# Altium schematic sheet Laser_module_supply.schdoc: Laser Module
size 420 x 297 mm; CheckedBy: MK; Author: G.K.; CompanyName: CREOTECH; DrawnBy: G.K.; Organization: CTI SA; Address1: Creotech Instruments SA; Address2: Okulickiego 7/9, 05-500 Poland; DocumentNumber: 5; Revision: -; SheetNumber: 5; SheetTotal: 5; ModifiedBy: -; CreateDate: XX/XX/XXXX; CheckedDate: -; Title2: Supply; DivGrp: CTI; Designer: G.K.; ModifiedDate: -; ProjectName: FMC DAC 100M 14B 16CHA ADC 2M 14B 4CHA
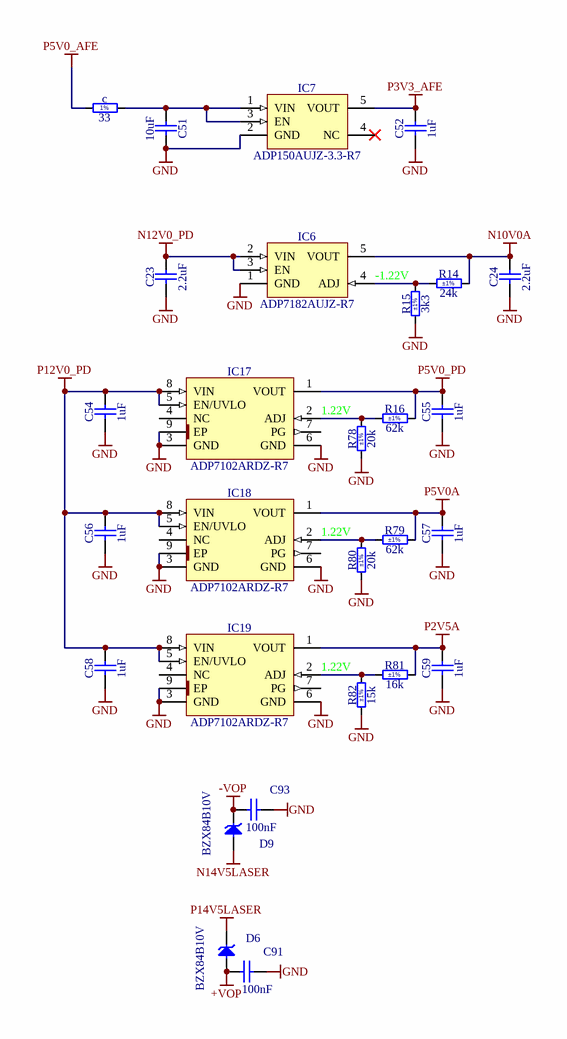
[diagram p0: Laser_module_supply.schdoc]

## Parts
c  33  [RESC1005X40N]
C23  2.2uF  [CAPC2012X135N]
C24  2.2uF  [CAPC2012X135N]
C51  10uF  [CAPC2012X135N]
C52  1uF  [CAPC1608X87N]
C54  1uF  [CAPC1608X87N]
C55  1uF  [CAPC1608X87N]
C56  1uF  [CAPC1608X87N]
C57  1uF  [CAPC1608X87N]
C58  1uF  [CAPC1608X87N]
C59  1uF  [CAPC1608X87N]
C91  100nF  [CAPC1608X87N]
C93  100nF  [CAPC1608X87N]
D6  BZX84B10V  [SOT95P248X115-3N]
D9  BZX84B10V  [SOT95P248X115-3N]
IC6  ADP7182AUJZ-R7  [SOT95P280X90-5N]
IC7  ADP150AUJZ-3.3-R7  [SOT95P280X90-5N]
IC17  ADP7102ARDZ-R7  [SOIC127P600X175-9N-R241X309]
IC18  ADP7102ARDZ-R7  [SOIC127P600X175-9N-R241X309]
IC19  ADP7102ARDZ-R7  [SOIC127P600X175-9N-R241X309]
R14  24k  Tolerance: ±1%  [RESC1005X40N]
R15  3k3  Tolerance: ±1%  [RESC1005X40N]
R16  62k  Tolerance: ±1%  [RESC1005X40N]
R78  20k  Tolerance: ±1%  [RESC1005X40N]
R79  62k  Tolerance: ±1%  [RESC1005X40N]
R80  20k  Tolerance: ±1%  [RESC1005X40N]
R81  16k  Tolerance: ±1%  [RESC1005X40N]
R82  15k  Tolerance: ±1%  [RESC1005X40N]

## Nets
+VOP: C91.1 D6.1(A)
-VOP: C93.1 D9.3(C)
GND: C23.1 C24.1 C51.2 C52.1 C54.1 C55.1 C56.1 C57.1 C58.1 C59.1 C91.2 C93.2 IC6.1(GND) IC7.2(GND) IC17.3(GND) IC17.6(GND) IC17.9(EP) IC18.3(GND) IC18.6(GND) IC18.9(EP) IC19.3(GND) IC19.6(GND) IC19.9(EP) R15.1 R78.1 R80.1 R82.1
N10V0A: C24.2 IC6.5(VOUT) R14.2
N12V0_PD: C23.2 IC6.2(VIN) IC6.3(EN)
N14V5LASER: D9.1(A)
P2V5A: C59.2 IC19.1(VOUT) R81.2
P3V3_AFE: C52.2 IC7.5(VOUT)
P5V0_AFE: c.1
P5V0_PD: C55.2 IC17.1(VOUT) R16.2
P5V0A: C57.2 IC18.1(VOUT) R79.2
P12V0_PD: C54.2 C56.2 C58.2 IC17.5(EN/UVLO) IC17.8(VIN) IC18.5(EN/UVLO) IC18.8(VIN) IC19.5(EN/UVLO) IC19.8(VIN)
P14V5LASER: D6.3(C)
Netc_2: c.2 C51.1 IC7.1(VIN) IC7.3(EN)
NetIC6_4: IC6.4(ADJ) R14.1 R15.2
NetIC17_2: IC17.2(ADJ) R16.1 R78.2
NetIC18_2: IC18.2(ADJ) R79.1 R80.2
NetIC19_2: IC19.2(ADJ) R81.1 R82.2

Not connected (* = marked no-connect by the designer): IC7 4(NC)*; IC17 4(NC) 7(PG); IC18 4(NC) 7(PG); IC19 4(NC) 7(PG)

## Notes on the sheet
- (near R15) -1.22V
- (near R78) 1.22V
- (near R80) 1.22V
- (near R82) 1.22V
- Project/Equipment
- Document
- Designer
- Drawn by
- Check.by
- Copyright Creotech Instruments SA 2014.
  This documentation describes Open Hardware and is licensed under the CERN OHL v.1.1. You may redistribute and modify this documentation under the terms of the CERN OHL v.1.1. (http://ohwr.org/CERNOHL). This documentation is distributed WITHOUT ANY EXPRESS OR IMPLIED WARRANTY, INCLUDING OF MERCHANTABILITY, SATISFACTORY QUALITY AND FITNESS FOR A PARTICULAR PURPOSE. Please see the CERN OHL v.1.1 for applicable conditions.
- File
- Last Mod.
- Print Date
- Sheet
- Size
- A3
- of
- Rev
- (in symbol R0402_33R_1%_0.0625W_100PPM) 1%

## Library data of the parts
c = R0402_33R_1%_0.0625W_100PPM: Resistor - 1%; Part Description: General Purpose Thick Film Chip Resistor; Manufacturer: GENERIC; Manufacturer1 Part Number: 232270673309L; TC: ±100ppm/°C; PressFit: No; Part Number: R0402_33R_1%_0.0625W_100PPM; Component Kind: Standard; Component Type: Standard; Pin Count: 2; Value: 33; Status: Not Recommended; Power: 0.0625W; Tolerance: ±1%; Manufacturer Part Number: R0402_33R_1%_0.0625W_100PPM; Case: 0402; Mounted: Yes; Sense: No; Socket: No; SMD: Yes; Manufacturer1 Example: YAGEO PHYCOMP; Manufacturer1 ComponentHeight: 0.4mm; HelpURL: \\cern.ch\dfs\Applications\Altium\Datasheets\R0402_Phycomp_RC0402.pdf; Author: CERN DEM JLC; CreateDate: 03/12/2007; LatestRevisionDate: 17/10/2012
C23 C24 = CC0805_2.2UF_16V_10%_X7R: Non-polarised capacitor; Part Description: SMD Multilayer Chip Ceramic Capacitor; Manufacturer: GENERIC; Manufacturer1 Part Number: GRM21BF51C225ZA01L; Voltage: 16V; TC: X7R; Tolerance: ±10%; Part Number: CC0805_2.2UF_16V_10%_X7R; Component Kind: Standard; Component Type: Standard; Pin Count: 2; Value: 2.2uF; Status: Preferred; Manufacturer Part Number: CC0805_2.2UF_16V_10%_X7R; Case: 0805; Mounted: Yes; Socket: No; SMD: Yes; Sense: No; Manufacturer1 Example: MURATA; Manufacturer1 ComponentHeight: 1.5mm; HelpURL: \\cern.ch\dfs\Applications\Altium\Datasheets\CC0805_X7R_MURATA_GRM.pdf; Author: CERN DEM JLC; CreateDate: 03.12.2007; LatestRevisionDate: 18.09.2014
C51 = CC0805_10UF_16V_10%_X5R: Non-polarised capacitor; Part Description: SMD Multilayer Chip Ceramic Capacitor; Manufacturer: GENERIC; Manufacturer1 Part Number: C0805C106K4PAC; Voltage: 16V; TC: X5R; Tolerance: ±10%; Part Number: CC0805_10UF_16V_10%_X5R; Component Kind: Standard; Component Type: Standard; Pin Count: 2; Value: 10uF; Status: Preferred; Manufacturer Part Number: CC0805_10UF_16V_10%_X5R; Case: 0805; Mounted: Yes; Socket: No; SMD: Yes; Manufacturer1 Example: KEMET; Manufacturer1 ComponentHeight: 1.4mm; HelpURL: \\cern.ch\dfs\Applications\Altium\Datasheets\CC1206_X5R_KEMET.pdf; Author: CERN DEM JLC; CreateDate: 03.12.2007; LatestRevisionDate: 03.12.2007; Sense: No
C52 C54-C59 = CC0603_1UF_25V_10%_X7R: Non-polarised capacitor; Part Description: SMD Multilayer Chip Ceramic Capacitor; Manufacturer: GENERIC; Manufacturer1 Part Number: GRM188R71E105KA12D; Voltage: 25V; TC: X7R; Tolerance: ±10%; Part Number: CC0603_1UF_25V_10%_X7R; Component Kind: Standard; Component Type: Standard; Pin Count: 2; Value: 1uF; Status: None; Manufacturer Part Number: CC0603_1UF_25V_10%_X7R; Case: 0603; Mounted: Yes; Socket: No; SMD: Yes; Sense: No; Manufacturer1 Example: MURATA; Manufacturer1 ComponentHeight: 0.9mm; HelpURL: \\cern.ch\dfs\Applications\Altium\Datasheets\CC0603_X7R_MURATA.pdf; Author: CERN DEM JLC; CreateDate: 18/01/2011; LatestRevisionDate: 18/01/2011
C91 C93 = CC0603_100NF_50V_10%_X7R: Non-polarised capacitor; Part Description: SMD Multilayer Chip Ceramic Capacitor; Manufacturer: GENERIC; Manufacturer1 Part Number: 223858615649; Voltage: 50V; TC: X7R; Tolerance: ±10%; Part Number: CC0603_100NF_50V_10%_X7R; Component Kind: Standard; Component Type: Standard; Pin Count: 2; Value: 100nF; Status: Preferred; Manufacturer Part Number: CC0603_100NF_50V_10%_X7R; Case: 0603; Mounted: Yes; Socket: No; SMD: Yes; Sense: No; Manufacturer1 Example: PHYCOMP; Manufacturer1 ComponentHeight: 0.87mm; HelpURL: \\cern.ch\dfs\Applications\Altium\Datasheets\CC0603_X7R_PHYCOMP.pdf; Author: CERN DEM JLC; CreateDate: 03.12.2007; LatestRevisionDate: 03.12.2007
D6 D9 = BZX84B10V: Diode Zener Anode Pin 1 Cathode Pin 3 (Pas de pin 2); Part Description: Small Signal Zener Diode; Manufacturer: VISHAY SEMICONDUCTORS; Voltage: 10V; Power: 300mW; PressFit: No; Bonding: No; Part Number: BZX84B10V; Component Kind: Standard; Component Type: Standard; Device: BZX84B10V; PackageDescription: SOT, 0.95mm Pitch; 3 Pin, 1.315mm W X 2.95mm L X 1.15mm H body, IPC Medium Density; Manufacturer Part Number: BZX84B10V; Pin Count: 2; Case: SOT23-3; Mounted: Yes; Socket: No; SMD: Yes; Sense: No; ComponentHeight: 1.15mm; HelpURL: \\cern.ch\dfs\Applications\Altium\Datasheets\BZX84B10V.pdf; Author: CERN DEM JLC; CreateDate: 23.10.2013; LatestRevisionDate: 23.10.2013
IC6 = ADP7182AUJZ-R7: -1.22V to -27V, -200mA, Adjustable, Low Noise, Negative Linear Regulator; Manufacturer: ANALOG DEVICES; PressFit: No; Bonding: No; Part Number: ADP7182AUJZ-R7; Component Kind: Standard; Component Type: Standard; Device: ADP7182AUJZ-R7; PackageDescription: SOT23, 0.95mm Pitch; 5 Pin, 1.75mm W X 3.00mm L X 0.90mm H body, IPC Medium Density; Part Description: -1.22V to -27V, -200mA, Adjustable, Low Noise, Negative Linear Regulator; Manufacturer Part Number: ADP7182AUJZ-R7; Pin Count: 5; Case: SOT23-5; Mounted: Yes; Socket: No; SMD: Yes; Sense: No; ComponentHeight: 0.9mm; HelpURL: \\cern.ch\dfs\Applications\Altium\Datasheets\ADP7182AUJZ-R7.pdf; Author: CERN DEM JLC; CreateDate: 16.06.2014; LatestRevisionDate: 16.06.2014
IC7 = ADP150AUJZ-3.3-R7: Ultralow Noise, 150 mA CMOS Linear Regulator; Part Description: 3.3V, 150mA, Ultralow Noise, CMOS Linear Regulator; Manufacturer: ANALOG DEVICES; PressFit: No; Bonding: No; Part Number: ADP150AUJZ-3.3-R7; Component Kind: Standard; Component Type: Standard; Device: ADP150AUJZ-3.3-R7; PackageDescription: SOT23, 0.95mm pitch; 5 pin, 1.75mm W X 3.00mm L, IPC Medium Density; Manufacturer Part Number: ADP150AUJZ-3.3-R7; Pin Count: 5; Case: SOT23; Mounted: Yes; Socket: No; SMD: Yes; Sense: No; ComponentHeight: 0.9mm; HelpURL: \\cern.ch\dfs\Applications\Altium\Datasheets\ADP150AUJZ-3.3-R7.pdf; Author: CERN DEM JLC; CreateDate: 27/09/2011; LatestRevisionDate: 19/06/2014
IC17-IC19 = ADP7102ARDZ-R7: 1.22V to 19V, 300mA, Low Noise, CMOS LDO Adjustable Linear Regulator; Manufacturer: ANALOG DEVICES; PressFit: No; Bonding: No; Part Number: ADP7102ARDZ-R7; Component Kind: Standard; Component Type: Standard; Device: ADP7102ARDZ-R7; PackageDescription: SOIC 8, Pitch 1.27mm - Body 3.9x4.9mm, (w/Thermal Tab 2.41mm X 3.098mm), IPC Medium Density; Part Description: 1.22V to 19V, 300mA, Low Noise, CMOS LDO Adjustable Linear Regulator; Manufacturer Part Number: ADP7102ARD; Pin Count: 8; Case: SOIC8; Mounted: Yes; Socket: No; SMD: Yes; Sense: No; ComponentHeight: 1.75mm; HelpURL: \\cern.ch\dfs\Applications\Altium\Datasheets\ADP7102ARDZ-R7.pdf; Author: CERN DEM JLC; CreateDate: 16.06.2014; LatestRevisionDate: 01.04.2022
R14 = R0402_24K_1%_0.0625W_100PPM: Resistor - 1%; Part Description: General Purpose Thick Film Chip Resistor; Manufacturer: GENERIC; Manufacturer1 Part Number: 232270672403L; TC: ±100ppm/°C; PressFit: No; Part Number: R0402_24K_1%_0.0625W_100PPM; Component Kind: Standard; Component Type: Standard; Pin Count: 2; Value: 24k; Status: Not Recommended; Power: 0.0625W; Manufacturer Part Number: R0402_24K_1%_0.0625W_100PPM; Case: 0402; Mounted: Yes; Sense: No; Socket: No; SMD: Yes; Manufacturer1 Example: YAGEO PHYCOMP; Manufacturer1 ComponentHeight: 0.4mm; HelpURL: \\cern.ch\dfs\Applications\Altium\Datasheets\R0402_Phycomp_RC0402.pdf; Author: CERN DEM JLC; CreateDate: 03.12.2007; LatestRevisionDate: 17.10.2012
R15 = R0402_3K3_1%_0.0625W_100PPM: Resistor - 1%; Part Description: General Purpose Thick Film Chip Resistor; Manufacturer: GENERIC; Manufacturer1 Part Number: 232270673302L; TC: ±100ppm/°C; PressFit: No; Part Number: R0402_3K3_1%_0.0625W_100PPM; Component Kind: Standard; Component Type: Standard; Pin Count: 2; Value: 3k3; Status: Not Recommended; Power: 0.0625W; Manufacturer Part Number: R0402_3K3_1%_0.0625W_100PPM; Case: 0402; Mounted: Yes; Sense: No; Socket: No; SMD: Yes; Manufacturer1 Example: YAGEO PHYCOMP; Manufacturer1 ComponentHeight: 0.4mm; HelpURL: \\cern.ch\dfs\Applications\Altium\Datasheets\R0402_Phycomp_RC0402.pdf; Author: CERN DEM JLC; CreateDate: 03.12.2007; LatestRevisionDate: 17.10.2012
R16 R79 = R0402_62K_1%_0.0625W_100PPM: Resistor - 1%; Part Description: General Purpose Thick Film Chip Resistor; Manufacturer: GENERIC; Manufacturer1 Part Number: 232270676203L; TC: ±100ppm/°C; PressFit: No; Part Number: R0402_62K_1%_0.0625W_100PPM; Component Kind: Standard; Component Type: Standard; Pin Count: 2; Value: 62k; Status: Not Recommended; Power: 0.0625W; Manufacturer Part Number: R0402_62K_1%_0.0625W_100PPM; Case: 0402; Mounted: Yes; Sense: No; Socket: No; SMD: Yes; Manufacturer1 Example: YAGEO PHYCOMP; Manufacturer1 ComponentHeight: 0.4mm; HelpURL: \\cern.ch\dfs\Applications\Altium\Datasheets\R0402_Phycomp_RC0402.pdf; Author: CERN DEM JLC; CreateDate: 03.12.2007; LatestRevisionDate: 17.10.2012
R78 R80 = R0402_20K_1%_0.0625W_100PPM: Resistor - 1%; Part Description: General Purpose Thick Film Chip Resistor; Manufacturer: GENERIC; Manufacturer1 Part Number: 232270672003L; TC: ±100ppm/°C; PressFit: No; Part Number: R0402_20K_1%_0.0625W_100PPM; Component Kind: Standard; Component Type: Standard; Pin Count: 2; Value: 20k; Status: Not Recommended; Power: 0.0625W; Manufacturer Part Number: R0402_20K_1%_0.0625W_100PPM; Case: 0402; Mounted: Yes; Sense: No; Socket: No; SMD: Yes; Manufacturer1 Example: YAGEO PHYCOMP; Manufacturer1 ComponentHeight: 0.4mm; HelpURL: \\cern.ch\dfs\Applications\Altium\Datasheets\R0402_Phycomp_RC0402.pdf; Author: CERN DEM JLC; CreateDate: 03.12.2007; LatestRevisionDate: 17.10.2012
R81 = R0402_16K_1%_0.0625W_100PPM: Resistor - 1%; Part Description: General Purpose Thick Film Chip Resistor; Manufacturer: GENERIC; Manufacturer1 Part Number: 232270671603L; TC: ±100ppm/°C; PressFit: No; Part Number: R0402_16K_1%_0.0625W_100PPM; Component Kind: Standard; Component Type: Standard; Pin Count: 2; Value: 16k; Status: Not Recommended; Power: 0.0625W; Manufacturer Part Number: R0402_16K_1%_0.0625W_100PPM; Case: 0402; Mounted: Yes; Sense: No; Socket: No; SMD: Yes; Manufacturer1 Example: YAGEO PHYCOMP; Manufacturer1 ComponentHeight: 0.4mm; HelpURL: \\cern.ch\dfs\Applications\Altium\Datasheets\R0402_Phycomp_RC0402.pdf; Author: CERN DEM JLC; CreateDate: 03.12.2007; LatestRevisionDate: 17.10.2012
R82 = R0402_15K_1%_0.0625W_100PPM: Resistor - 1%; Part Description: General Purpose Thick Film Chip Resistor; Manufacturer: GENERIC; Manufacturer1 Part Number: CRCW040215K0FK; TC: ±100ppm/°C; PressFit: No; Part Number: R0402_15K_1%_0.0625W_100PPM; Component Kind: Standard; Component Type: Standard; Pin Count: 2; Value: 15k; Status: None; Power: 0.0625W; Manufacturer Part Number: R0402_15K_1%_0.0625W_100PPM; Case: 0402; Mounted: Yes; Sense: No; Socket: No; SMD: Yes; Manufacturer1 Example: VISHAY; Manufacturer1 ComponentHeight: 0.4mm; HelpURL: \\cern.ch\dfs\Applications\Altium\Datasheets\R0402_VISHAY_CRCW e3.pdf; Author: CERN DEM JMW; CreateDate: 06.07.2015; LatestRevisionDate: 06.07.2015